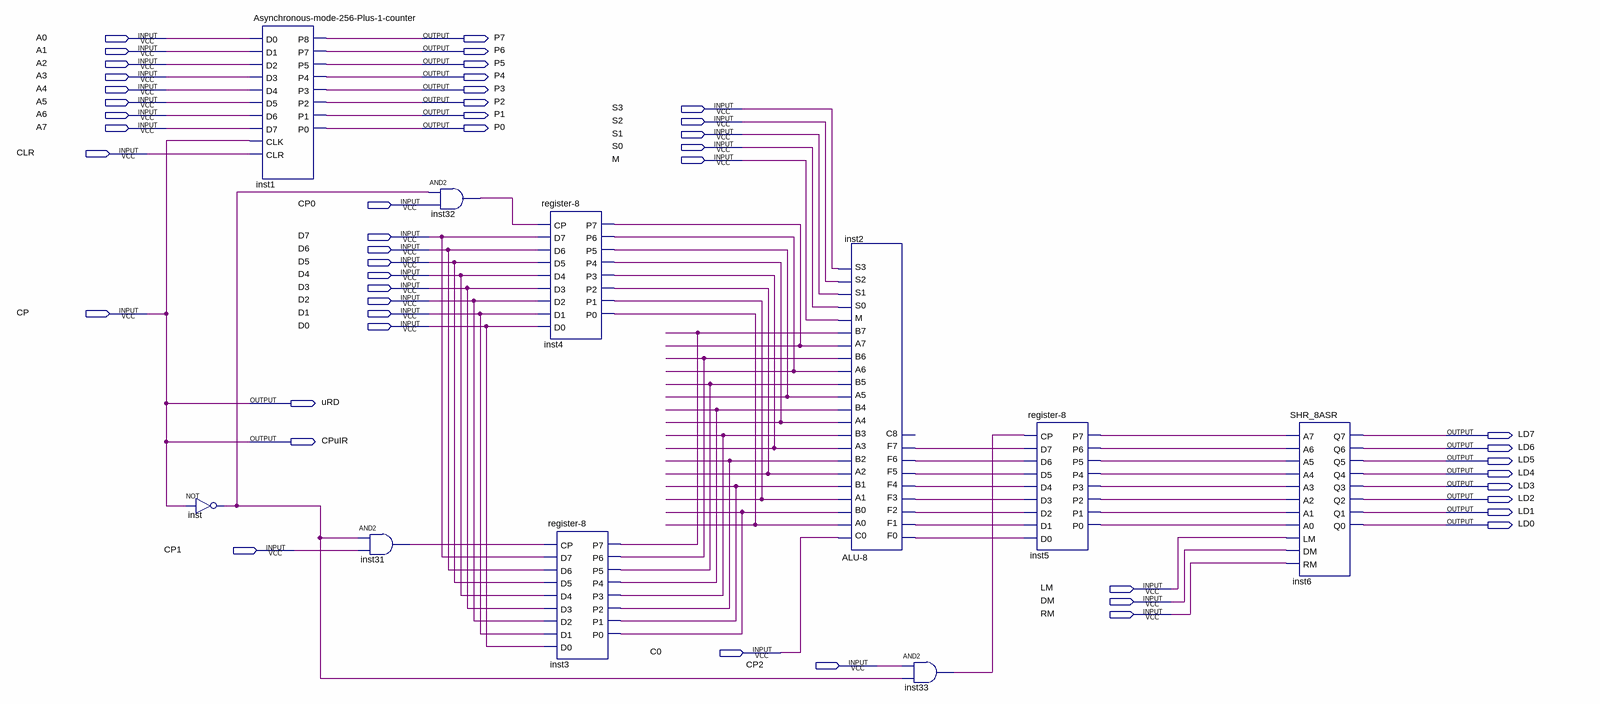
[diagram p0: schematic sheet]
// Quartus schematic uIR-Counter.bdf as structural Verilog: 10 symbols, 48 pins
module \uIR-Counter  (
  input  A0,
  input  A1,
  input  A2,
  input  A3,
  input  A4,
  input  A5,
  input  S3,
  input  A6,
  input  S2,
  input  A7,
  input  S1,
  input  S0,
  input  CLR,
  input  M,
  input  CP0,
  input  D7,
  input  D6,
  input  D5,
  input  D4,
  input  D3,
  input  D2,
  input  CP,
  input  D1,
  input  D0,
  input  CP1,
  input  LM,
  input  DM,
  input  RM,
  input  C0,
  input  CP2,
  output P7,
  output P6,
  output P5,
  output P4,
  output P3,
  output P2,
  output P1,
  output P0,
  output uRD,
  output LD7,
  output CPuIR,
  output LD6,
  output LD5,
  output LD4,
  output LD3,
  output LD2,
  output LD1,
  output LD0
);

  wire inst2_f0, inst2_f1, inst2_f2, inst2_f3, inst2_f4, inst2_f5, inst2_f6, inst2_f7, inst3_p0, inst3_p1,
       inst3_p2, inst3_p3, inst3_p4, inst3_p5, inst3_p6, inst3_p7, inst4_p0, inst4_p1, inst4_p2, inst4_p3,
       inst4_p4, inst4_p5, inst4_p6, inst4_p7, inst5_p0, inst5_p1, inst5_p2, inst5_p3, inst5_p4, inst5_p5,
       inst5_p6, inst5_p7, inst31_out, inst32_out, inst33_out, inst_out;

  not inst (inst_out, CP);
  \Asynchronous-mode-256-Plus-1-counter  inst1 (
    .D0(A0), .D1(A1), .D2(A2), .D3(A3), .D4(A4), .D5(A5), .D6(A6), .D7(A7), .CLK(CP), .CLR(CLR), .P8(P7),
    .P7(P6), .P5(P5), .P4(P4), .P3(P3), .P2(P2), .P1(P1), .P0(P0));
  and inst31 (inst31_out, inst_out, CP1);
  and inst32 (inst32_out, inst_out, CP0);
  \register-8  inst4 (
    .CP(inst32_out), .D7(D7), .D6(D6), .D5(D5), .D4(D4), .D3(D3), .D2(D2), .D1(D1), .D0(D0), .P7(inst4_p7),
    .P6(inst4_p6), .P5(inst4_p5), .P4(inst4_p4), .P3(inst4_p3), .P2(inst4_p2), .P1(inst4_p1), .P0(inst4_p0));
  \register-8  inst3 (
    .CP(inst31_out), .D7(D7), .D6(D6), .D5(D5), .D4(D4), .D3(D3), .D2(D2), .D1(D1), .D0(D0), .P7(inst3_p7),
    .P6(inst3_p6), .P5(inst3_p5), .P4(inst3_p4), .P3(inst3_p3), .P2(inst3_p2), .P1(inst3_p1), .P0(inst3_p0));
  \ALU-8  inst2 (
    .C0(C0), .A0(inst4_p0), .B0(inst3_p0), .A1(inst4_p1), .B1(inst3_p1), .A2(inst4_p2), .B2(inst3_p2),
    .A3(inst4_p3), .B3(inst3_p3), .A4(inst4_p4), .B4(inst3_p4), .A5(inst4_p5), .B5(inst3_p5), .A6(inst4_p6),
    .B6(inst3_p6), .A7(inst4_p7), .B7(inst3_p7), .M(M), .S0(S0), .S1(S1), .S2(S2), .S3(S3), .F0(inst2_f0),
    .F1(inst2_f1), .F2(inst2_f2), .F3(inst2_f3), .F4(inst2_f4), .F5(inst2_f5), .F6(inst2_f6), .F7(inst2_f7));  // open: C8
  and inst33 (inst33_out, CP2, inst_out);
  \register-8  inst5 (
    .CP(inst33_out), .D7(inst2_f7), .D6(inst2_f6), .D5(inst2_f5), .D4(inst2_f4), .D3(inst2_f3),
    .D2(inst2_f2), .D1(inst2_f1), .D0(inst2_f0), .P7(inst5_p7), .P6(inst5_p6), .P5(inst5_p5), .P4(inst5_p4),
    .P3(inst5_p3), .P2(inst5_p2), .P1(inst5_p1), .P0(inst5_p0));
  SHR_8ASR inst6 (
    .A7(inst5_p7), .A6(inst5_p6), .A5(inst5_p5), .A4(inst5_p4), .A3(inst5_p3), .A2(inst5_p2), .A1(inst5_p1),
    .A0(inst5_p0), .LM(LM), .DM(DM), .RM(RM), .Q7(LD7), .Q6(LD6), .Q5(LD5), .Q4(LD4), .Q3(LD3), .Q2(LD2),
    .Q1(LD1), .Q0(LD0));

  assign CPuIR = CP;
  assign uRD = CP;
endmodule
